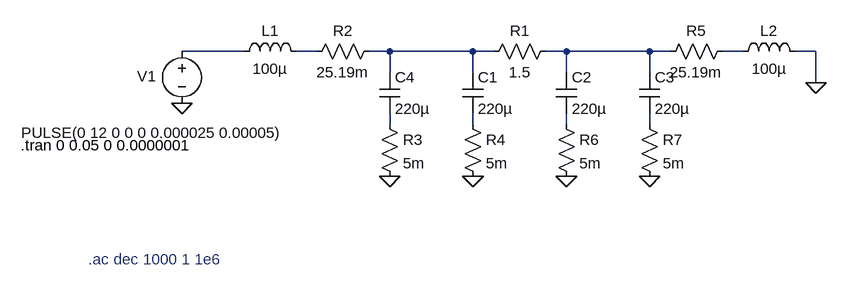
[diagram p0: schematic TEC_Driver.asc]
TEC_Driver.asc, the LTspice schematic file:
Version 4
SHEET 1 1076 680
WIRE 80 128 -16 128
WIRE 192 128 160 128
WIRE 304 128 272 128
WIRE 432 128 304 128
WIRE 464 128 432 128
WIRE 576 128 544 128
WIRE 704 128 576 128
WIRE 736 128 704 128
WIRE 848 128 816 128
WIRE 960 128 928 128
WIRE 304 160 304 128
WIRE 432 160 432 128
WIRE 576 160 576 128
WIRE 704 160 704 128
WIRE 960 176 960 128
WIRE 304 240 304 224
WIRE 432 240 432 224
WIRE 576 240 576 224
WIRE 704 240 704 224
FLAG 960 176 0
FLAG -16 208 0
FLAG 304 320 0
FLAG 432 320 0
FLAG 576 320 0
FLAG 704 320 0
SYMBOL ind 64 144 R270
WINDOW 0 32 56 VTop 2
WINDOW 3 5 56 VBottom 2
SYMATTR InstName L1
SYMATTR Value 100µ
SYMBOL ind 832 144 R270
WINDOW 0 32 56 VTop 2
WINDOW 3 5 56 VBottom 2
SYMATTR InstName L2
SYMATTR Value 100µ
SYMBOL res 448 144 R270
WINDOW 0 32 56 VTop 2
WINDOW 3 0 56 VBottom 2
SYMATTR InstName R1
SYMATTR Value 1.5
SYMBOL voltage -16 112 R0
WINDOW 3 -247 141 Left 2
WINDOW 123 -69 82 Left 2
WINDOW 39 0 0 Left 0
WINDOW 0 -69 54 Left 2
SYMATTR Value PULSE(0 12 0 0 0 0.000025 0.00005)
SYMATTR InstName V1
SYMBOL cap 288 160 R0
SYMATTR InstName C4
SYMATTR Value 220µ
SYMBOL res 288 112 R90
WINDOW 0 0 56 VBottom 2
WINDOW 3 32 56 VTop 2
SYMATTR InstName R2
SYMATTR Value 25.19m
SYMBOL res 832 112 R90
WINDOW 0 0 56 VBottom 2
WINDOW 3 32 56 VTop 2
SYMATTR InstName R5
SYMATTR Value 25.19m
SYMBOL cap 416 160 R0
SYMATTR InstName C1
SYMATTR Value 220µ
SYMBOL cap 560 160 R0
SYMATTR InstName C2
SYMATTR Value 220µ
SYMBOL cap 688 160 R0
SYMATTR InstName C3
SYMATTR Value 220µ
SYMBOL res 288 224 R0
SYMATTR InstName R3
SYMATTR Value 5m
SYMBOL res 416 224 R0
SYMATTR InstName R4
SYMATTR Value 5m
SYMBOL res 560 224 R0
SYMATTR InstName R6
SYMATTR Value 5m
SYMBOL res 688 224 R0
SYMATTR InstName R7
SYMATTR Value 5m
TEXT -264 272 Left 2 !.tran 0 0.05 0 0.0000001
TEXT -160 448 Left 2 ;.ac dec 1000 1 1e6

The netlist it stands for:
* TEC_Driver.asc
L1 N001 N002 100µ
L2 N005 0 100µ
R1 N003 N004 1.5
V1 N001 0 PULSE(0 12 0 0 0 0.000025 0.00005)
C4 N003 N006 220µ
R2 N003 N002 25.19m
R5 N005 N004 25.19m
C1 N003 N007 220µ
C2 N004 N008 220µ
C3 N004 N009 220µ
R3 N006 0 5m
R4 N007 0 5m
R6 N008 0 5m
R7 N009 0 5m
.tran 0 0.05 0 0.0000001
* .ac dec 1000 1 1e6
.backanno
.end